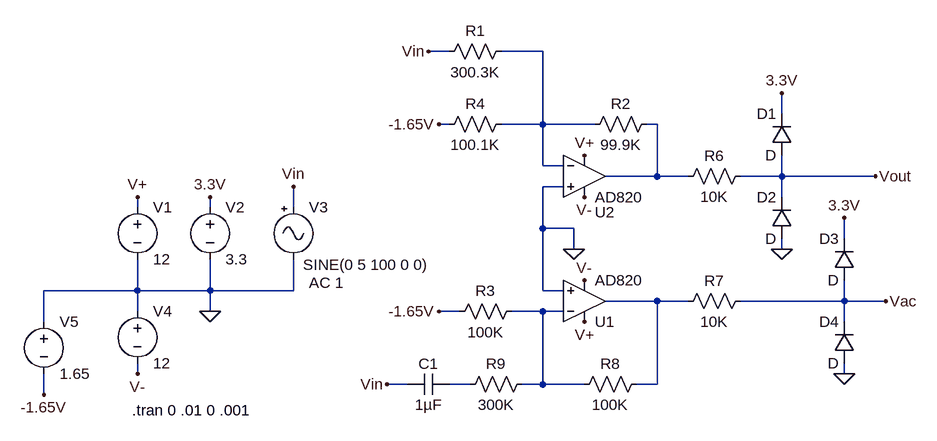
[diagram p0: schematic spank_input_new.asc]
spank_input_new.asc, the LTspice schematic file:
Version 4
SHEET 1 880 932
WIRE -192 256 -224 256
WIRE -48 256 -112 256
WIRE 320 352 320 320
WIRE -192 368 -208 368
WIRE -48 368 -48 256
WIRE -48 368 -112 368
WIRE 32 368 -48 368
WIRE 128 368 112 368
WIRE -48 432 -48 368
WIRE -16 432 -48 432
WIRE 128 448 128 368
WIRE 128 448 48 448
WIRE 176 448 128 448
WIRE 320 448 320 416
WIRE 320 448 256 448
WIRE 464 448 320 448
WIRE -16 464 -48 464
WIRE 320 480 320 448
WIRE -672 496 -672 480
WIRE -560 496 -560 480
WIRE -432 496 -432 464
WIRE -48 528 -48 464
WIRE 0 528 -48 528
WIRE 416 544 416 512
WIRE 0 560 0 528
WIRE 320 560 320 544
WIRE -672 624 -672 576
WIRE -672 624 -816 624
WIRE -560 624 -560 576
WIRE -560 624 -672 624
WIRE -432 624 -432 576
WIRE -432 624 -560 624
WIRE -48 624 -48 528
WIRE -16 624 -48 624
WIRE 128 640 48 640
WIRE 176 640 128 640
WIRE 416 640 416 608
WIRE 416 640 256 640
WIRE 480 640 416 640
WIRE -672 656 -672 624
WIRE -560 656 -560 624
WIRE -176 656 -208 656
WIRE -48 656 -96 656
WIRE -16 656 -48 656
WIRE -816 672 -816 624
WIRE 416 672 416 640
WIRE -672 752 -672 736
WIRE 416 752 416 736
WIRE -256 768 -288 768
WIRE -160 768 -192 768
WIRE -48 768 -48 656
WIRE -48 768 -80 768
WIRE 16 768 -48 768
WIRE 128 768 128 640
WIRE 128 768 96 768
WIRE -816 784 -816 752
FLAG -560 656 0
FLAG -672 480 V+
FLAG 16 416 V+
FLAG -672 752 V-
FLAG 16 480 V-
FLAG 16 608 V-
FLAG 16 672 V+
FLAG 464 448 Vout
FLAG 480 640 Vac
FLAG -560 480 3.3V
FLAG 320 320 3.3V
FLAG 320 560 0
FLAG -432 464 Vin
FLAG -224 256 Vin
FLAG -288 768 Vin
FLAG 416 512 3.3V
FLAG 416 752 0
FLAG 0 560 0
FLAG -816 784 -1.65V
FLAG -208 368 -1.65V
FLAG -208 656 -1.65V
SYMBOL res 128 352 R90
WINDOW 0 0 56 VBottom 2
WINDOW 3 32 56 VTop 2
SYMATTR InstName R2
SYMATTR Value 99.9K
SYMATTR SpiceLine tol=.1
SYMBOL Misc\\signal -432 480 R0
WINDOW 123 24 132 Left 2
WINDOW 39 0 0 Left 0
WINDOW 3 15 104 Left 2
SYMATTR Value2 AC 1
SYMATTR Value SINE(0 5 100 0 0)
SYMATTR InstName V3
SYMBOL voltage -560 480 R0
WINDOW 123 0 0 Left 0
WINDOW 39 0 0 Left 0
SYMATTR InstName V2
SYMATTR Value 3.3
SYMBOL Opamps\\AD820 16 384 R0
WINDOW 0 16 119 Left 2
SYMATTR InstName U2
SYMBOL voltage -672 480 R0
WINDOW 123 0 0 Left 0
WINDOW 39 0 0 Left 0
SYMATTR InstName V1
SYMATTR Value 12
SYMBOL voltage -672 640 R0
WINDOW 123 0 0 Left 0
WINDOW 39 0 0 Left 0
SYMATTR InstName V4
SYMATTR Value 12
SYMBOL res -96 240 R90
WINDOW 0 0 56 VBottom 2
WINDOW 3 32 56 VTop 2
SYMATTR InstName R1
SYMATTR Value 300.3K
SYMATTR SpiceLine tol=.1
SYMBOL Opamps\\AD820 16 704 M180
SYMATTR InstName U1
SYMBOL res 272 432 R90
WINDOW 0 0 56 VBottom 2
WINDOW 3 32 56 VTop 2
SYMATTR InstName R6
SYMATTR Value 10K
SYMBOL cap -256 784 R270
WINDOW 0 32 32 VTop 2
WINDOW 3 0 32 VBottom 2
SYMATTR InstName C1
SYMATTR Value 1µF
SYMBOL res -96 352 R90
WINDOW 0 0 56 VBottom 2
WINDOW 3 32 56 VTop 2
SYMATTR InstName R4
SYMATTR Value 100.1K
SYMATTR SpiceLine tol=.1
SYMBOL diode 336 416 R180
WINDOW 0 24 64 Left 2
WINDOW 3 24 0 Left 2
SYMATTR InstName D1
SYMBOL diode 336 544 R180
WINDOW 0 24 64 Left 2
WINDOW 3 24 0 Left 2
SYMATTR InstName D2
SYMBOL res 112 752 R90
WINDOW 0 0 56 VBottom 2
WINDOW 3 32 56 VTop 2
SYMATTR InstName R8
SYMATTR Value 100K
SYMBOL res -64 752 R90
WINDOW 0 0 56 VBottom 2
WINDOW 3 32 56 VTop 2
SYMATTR InstName R9
SYMATTR Value 300K
SYMBOL res 272 624 R90
WINDOW 0 0 56 VBottom 2
WINDOW 3 32 56 VTop 2
SYMATTR InstName R7
SYMATTR Value 10K
SYMBOL diode 432 608 R180
WINDOW 0 24 64 Left 2
WINDOW 3 24 0 Left 2
SYMATTR InstName D3
SYMBOL diode 432 736 R180
WINDOW 0 24 64 Left 2
WINDOW 3 24 0 Left 2
SYMATTR InstName D4
SYMBOL voltage -816 656 R0
WINDOW 123 0 0 Left 0
WINDOW 39 0 0 Left 0
SYMATTR InstName V5
SYMATTR Value 1.65
SYMBOL res -80 640 R90
WINDOW 0 0 56 VBottom 2
WINDOW 3 32 56 VTop 2
SYMATTR InstName R3
SYMATTR Value 100K
TEXT -680 808 Left 2 !.tran 0 .01 0 .001

The netlist it stands for:
* spank_input_new.asc
R2 N002 N001 99.9K tol=.1
V3 Vin 0 SINE(0 5 100 0 0) AC 1
V2 3.3V 0 3.3
XU2 0 N001 V+ V- N002 AD820  ; pins In+ In- V+ V- OUT
V1 V+ 0 12
V4 0 V- 12
R1 N001 Vin 300.3K tol=.1
XU1 0 N004 V+ V- N003 AD820  ; pins In+ In- V+ V- OUT
R6 Vout N002 10K
C1 Vin N005 1µF
R4 N001 -1.65V 100.1K tol=.1
D1 Vout 3.3V D
D2 0 Vout D
R8 N003 N004 100K
R9 N004 N005 300K
R7 Vac N003 10K
D3 Vac 3.3V D
D4 0 Vac D
V5 0 -1.65V 1.65
R3 N004 -1.65V 100K
.model D D
.lib standard.dio
.tran 0 .01 0 .001
.backanno
.end